# EAGLE design counter-defender-esp8266-mk-1.0 (EAGLE 7.5.0)
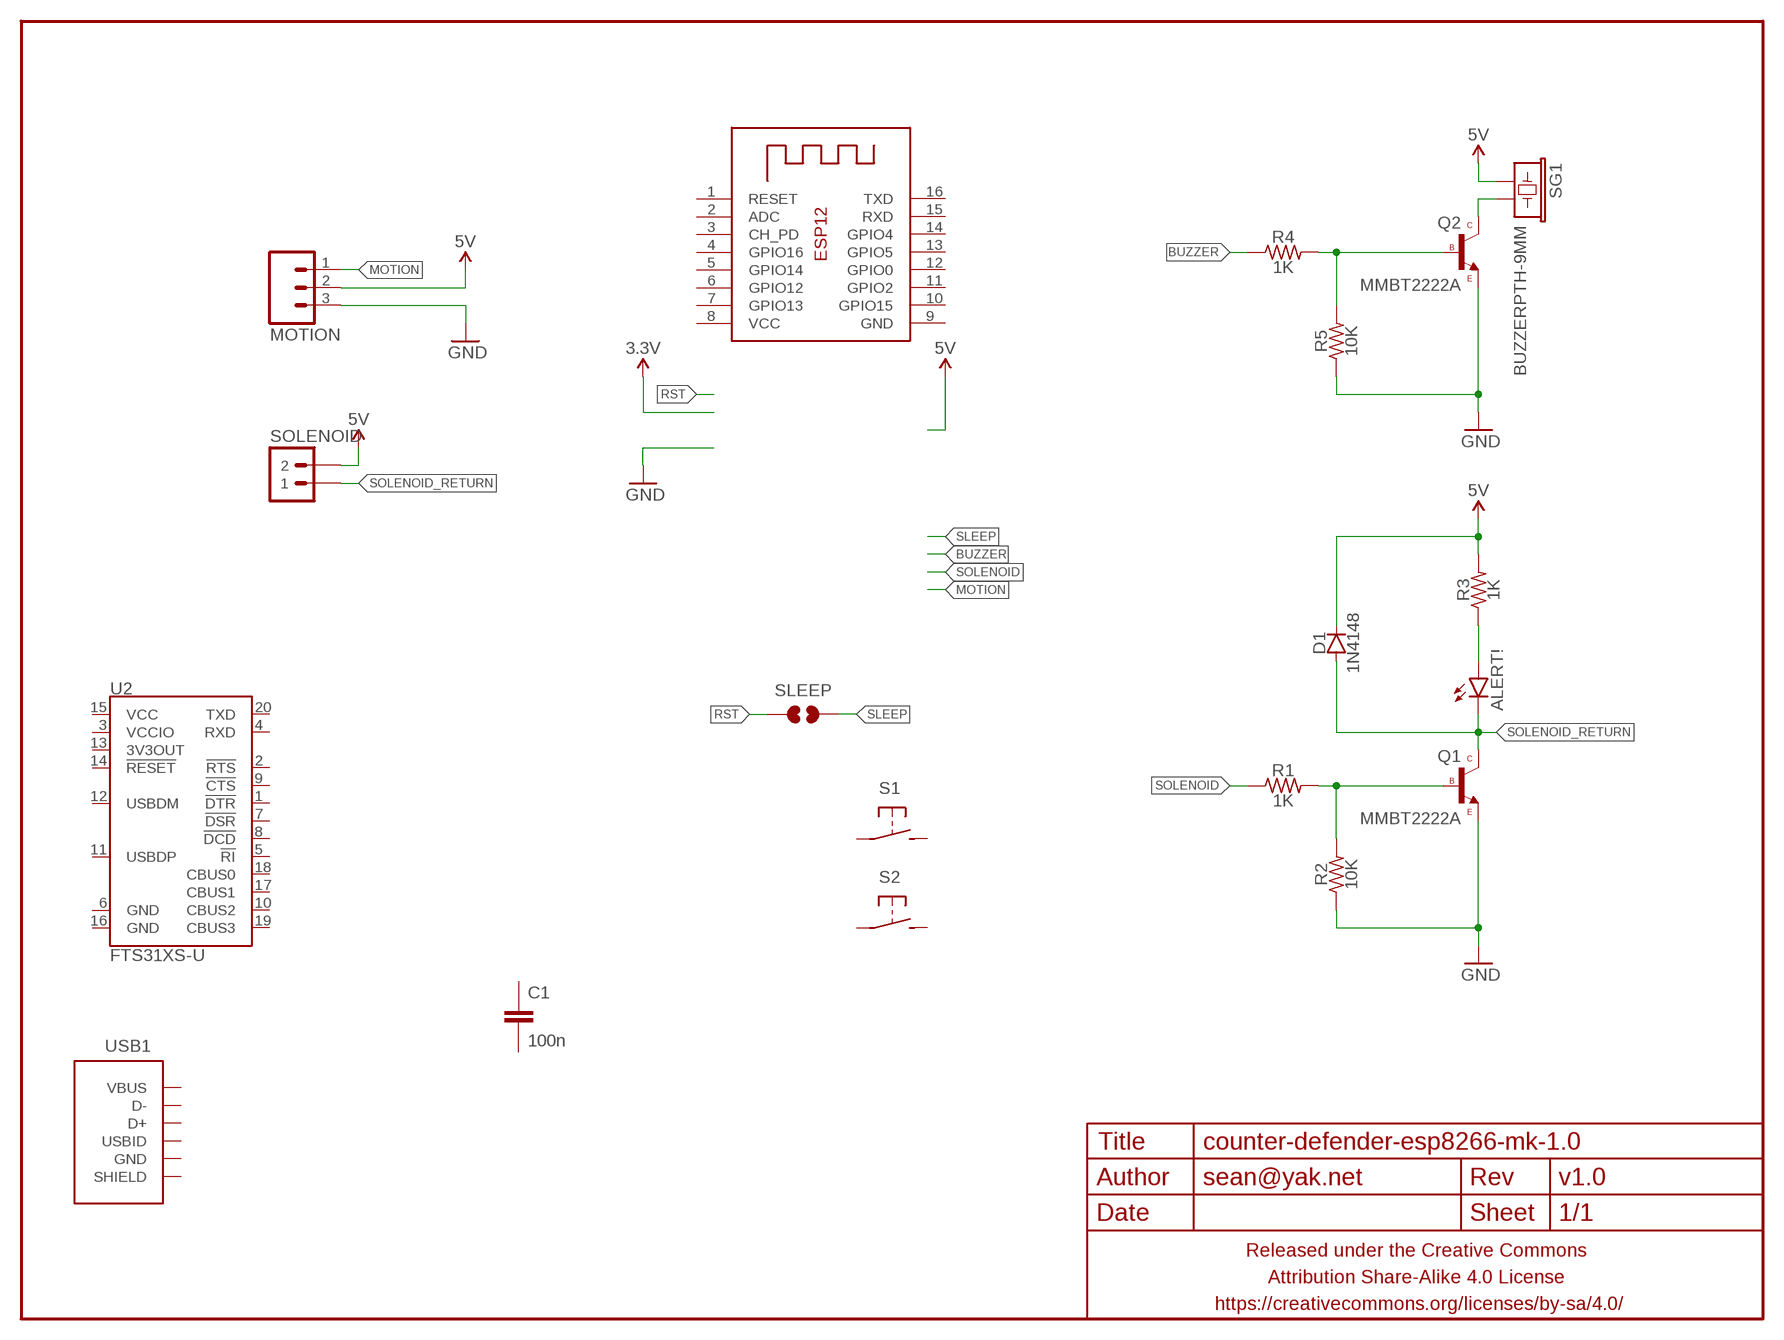
[diagram p0: schematic, sheet 1]

## Parts
ALERT!  LED0603-TIGHT  [LED-0603-TIGHT]
C1  100n  CAPACITOR-CERAMICC0603-TIGHTER  [C0603-TIGHTER]
D1  1N4148  DIODESOD123  [SOD123]
FRAME1  FRAME-LETTERNO_PACKAGE  [DUMMY]
MOTION  M03PTH-CENTERED  [1X03-CENTERED]
Q1  MMBT2222A  TRANSISTOR_NPNMMBT2222A  [SOT23]
Q2  MMBT2222A  TRANSISTOR_NPNMMBT2222A  [SOT23]
R1  1K  RESISTORR0603-TIGHTER  [R0603-TIGHTER]
R2  10K  RESISTORR0603-TIGHTER  [R0603-TIGHTER]
R3  1K  RESISTORR0603-TIGHTER  [R0603-TIGHTER]
R4  1K  RESISTORR0603-TIGHTER  [R0603-TIGHTER]
R5  10K  RESISTORR0603-TIGHTER  [R0603-TIGHTER]
S1  SPST-NO-TACTSMD-TINIER  [TACTILE_SWITCH_SMD_TINY]
S2  SPST-NO-TACTSMD-TINIER  [TACTILE_SWITCH_SMD_TINY]
SG1  BUZZERPTH-9MM  [BUZZER-PTH-9MM]
SLEEP  JUMPER-PAD-2-NOYES_SILK  [PAD-JUMPER-2-NO_YES_SILK]
SOLENOID  M02PTH-CENTERED  [1X02-CENTER]
U1  ESP-12  [ESP-12]
U2  FTS31XS-U  FT231XS  [SSOP20_L]
USB1  USB-AB-SHIELDFCI-10118193-USB-MICRO-B  [FCI-10118193-USB-MICRO-B]

## Nets
5V: D1.C MOTION.2 R3.2 SG1.+ SOLENOID.2
BUZZER: R4.1
GND: MOTION.3 Q1.2(E) Q2.2(E) R2.1 R5.1
MOTION: MOTION.1
N$1: ALERT!.A R3.1
N$2: Q1.1(B) R1.2 R2.2
N$3: Q2.3(C) SG1.-
N$5: Q2.1(B) R4.2 R5.2
RST: SLEEP.1
SLEEP: SLEEP.2
SOLENOID: R1.1
SOLENOID_RETURN: ALERT!.C D1.A Q1.3(C) SOLENOID.1
Unconnected: C1.1 C1.2 S1.P$1 S1.P$2 S2.P$1 S2.P$2 U1.1(RESET) U1.2(ADC) U1.3(CH_PD) U1.4(GPIO16) U1.5(GPIO14) U1.6(GPIO12) U1.7(GPIO13) U1.10(GPIO15) U1.11(GPIO2) U1.12(GPIO0) U1.13(GPIO5) U1.14(GPIO4) U1.15(RXD) U1.16(TXD) U2.1(!DTR) U2.2(!RTS) U2.3(VCCIO) U2.4(RXD) U2.5(!RI) U2.6(GND) U2.7(!DSR) U2.8(!DCD) U2.9(!CTS) U2.10(CBUS2) U2.11(USBDP) U2.12(USBDM) U2.13(3V3OUT) U2.14(!RESET) U2.15(VCC) U2.16(GND) U2.17(CBUS1) U2.18(CBUS0) U2.19(CBUS3) U2.20(TXD) USB1.1(VBUS) USB1.2(D-) USB1.3(D+) USB1.4(USBID) USB1.5(GND) USB1.SHIELD@1(SHIELD) USB1.SHIELD@2(SHIELD) USB1.SHIELD@3(SHIELD) USB1.SHIELD@4(SHIELD)

## Power pins joined to a net without a drawn wire
GND: U1.9(GND)
VCC: U1.8(VCC)

## Library data of the parts
ALERT! = a_parts:LED: LEDs Standard schematic elements and footprints for 5mm, 3mm, 1206, and 0603 sized LEDs. 5mm - Spark Fun Electronics SKU : COM-00529 (and others)
C1 = a_parts:CAPACITOR-CERAMIC: CAPACITOR, European symbol
D1 = a_parts:DIODE: Diode These are standard reverse protection diodes and small signal diodes. SMA package can handle up to about 1A. SOD-323 can handle about 200mA. What the SOD-323 package when ordering, there are some mfgs out there that are 5-pin packages.
FRAME1 = a_parts:FRAME-LETTER: Schematic Frame Standard 8.5x11 US Letter frame; DESIGNER: sean@yak.net; VERSION: v1.0
MOTION = a_parts:M03: Header 3 Standard 3-pin 0.1" header. Use with straight break away headers (SKU : PRT-00116), right angle break away headers (PRT-00553), swiss pins (PRT-00743), machine pins (PRT-00117), and female headers (PRT-00115). Molex polarized connector foot print use with SKU : PRT-08232 with associated crimp pins and housings.
Q1 Q2 = a_parts:TRANSISTOR_NPN: Generic NPN BJT MMBT2222A - TRANS-08049 (SOT-23, 1A 40V) MPSA42 - TRANS-09116 (SOT-23, 500mA 300V) MMBT5088LT1G - TRANS-11160 (SOT-23, 50 mA 30V) BC547 - COM-08928 <http://www.sparkfun.com/products/8928> (TO-92 45V 100mA) (1.Collector 2.Base 3.Emitter) 2N3904 - COM-00521 <http://www.sparkfun.com/products/521> (TO-92 40V 200mA) (1.Emitter 2.Base 3.Collector) P2N2222A - COM-12852 <http://www.sparkfun.com/products/12852> (TO-92 40V 600mA) (1.Collector 2.Base 3.Emitter)
R1-R5 = a_parts:RESISTOR: RESISTOR, American symbol
S1 S2 = a_parts:SPST-NO-TACT
SG1 = a_parts:BUZZER: Buzzer 12mm Spark Fun Electronics SKU : Comp-Buzzer
SLEEP = a_parts:JUMPER-PAD-2-NO
SOLENOID = a_parts:M02: Standard 2-pin 0.1" header. Use with - straight break away headers ( PRT-00116) - right angle break away headers (PRT-00553) - swiss pins (PRT-00743) - machine pins (PRT-00117) - female headers (PRT-00115) Molex polarized connector foot print use with: PRT-08233 with associated crimp pins and housings. 2.54_SCREWTERM for use with PRT-10571. 3.5mm Screw Terminal footprints for PRT-08084 5mm Screw Terminal footprints for use with PRT-08433
U1 = a_parts:ESP-12
U2 = a_parts:FT231X: FTDI FT231X Full Speed USB to Full-handshake UART This USB2.0 Full Speed IC offers a compact bridge to full handshake UART interfaces. The device is a UART, capable of operating up to 3MBaud, with low power consumption (8mA). The FT231X includes the complete FT-X series feature set and enables USB to be added into a system design quickly and easily over a UART interface.; PROD_ID: IC-11524
USB1 = a_parts:USB-AB-SHIELD

## Board
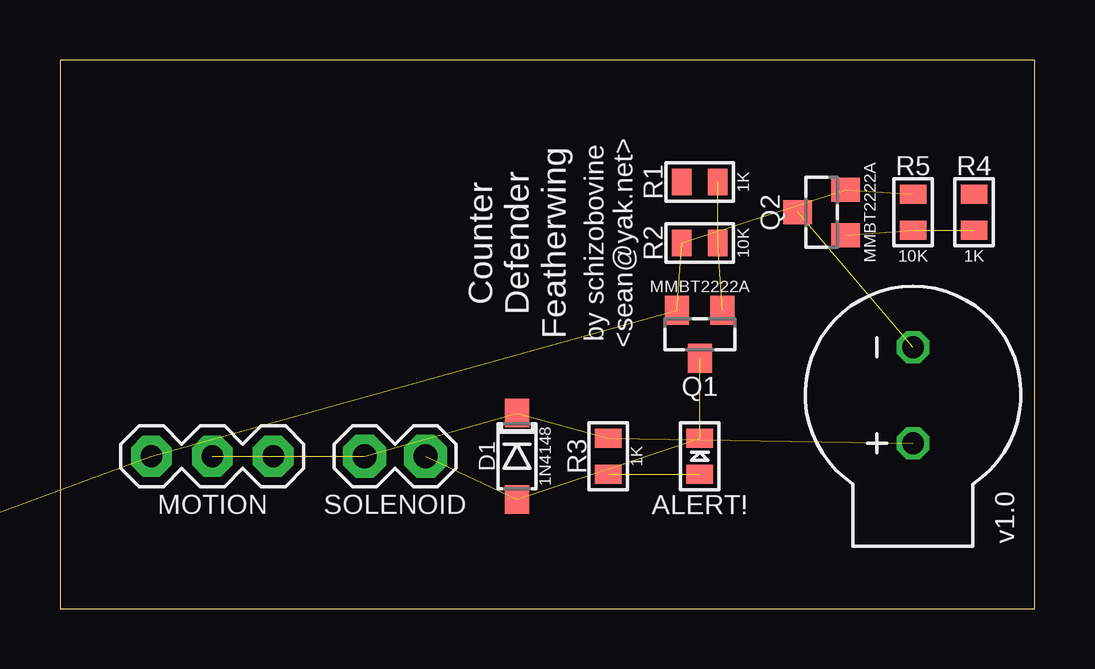
[diagram p1: board, top side]
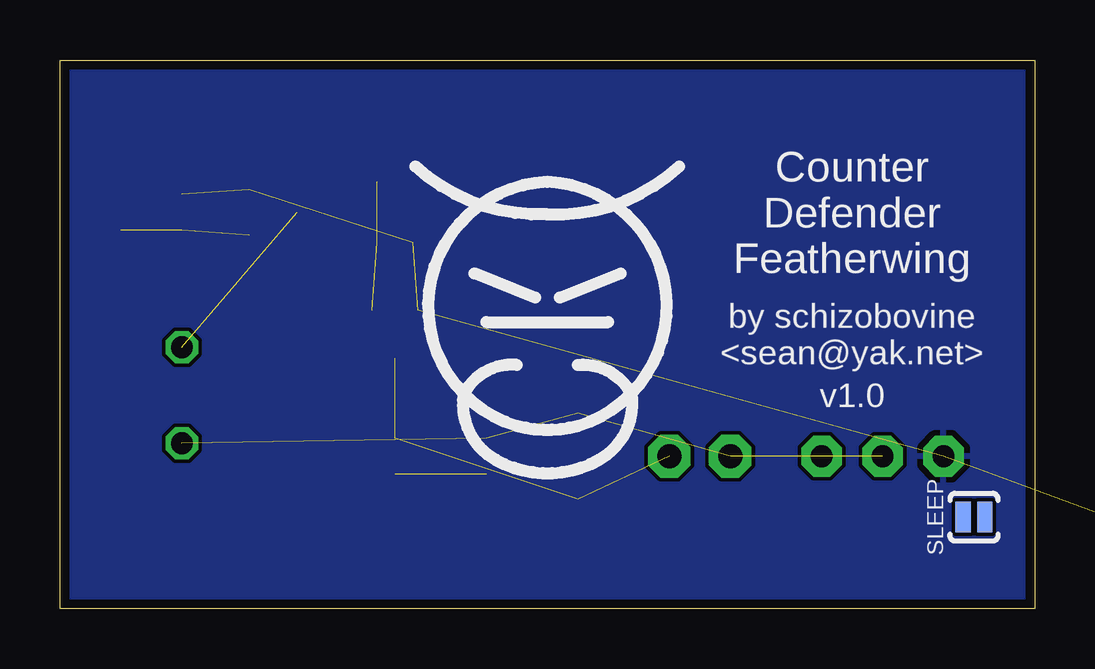
[diagram p2: board, bottom side, seen from below]

Size 40.64 x 22.86 mm. Coordinates in mm from the lower left corner, seen from the top.
Outline: 0,0 40.64,0 40.64,22.86 0,22.86 0,0
Copper layers (1*16): Top 0.0356mm / dielectric 1.5011mm / Bottom 0.0356mm
Design rules "LaenPCBOrder2": minimum track width 6mil, minimum drill 13mil, track to track 6mil, track to pad 6mil, pad to pad 6mil, via to via 6mil, smd to smd 6mil, copper to edge 15mil, drill to drill 6mil, minimum pad ring 7mil, minimum via ring 7mil, stop-mask expansion 3mil, vias tented up to drill 20mil, thermal gap 10mil

### Footprints (pad centres in the part's own frame; a part is rotated, then mirrored left to right if it is on the bottom)
LED-0603-TIGHT = smd 0.8 x 1.1: A 0.75,0; C -0.75,0
C0603-TIGHTER = smd 0.8 x 1.1: 1 -0.75,0; 2 0.75,0
SOD123 = smd 1.2 x 1: A -1.8,0; C 1.8,0
1X03-CENTERED = drill 0.9 pad 1.7 octagon: 1 -2.54,0; 2 0,0; 3 2.54,0
SOT23 = smd 1 x 1.2: 1 -0.95,-1; 2 0.95,-1; 3 0,1
R0603-TIGHTER = smd 0.8 x 1.1: 1 -0.75,0; 2 0.75,0
TACTILE_SWITCH_SMD_TINY = smd 1.27 x 1.5: P$1 -2.5,0; P$2 2.5,0
BUZZER-PTH-9MM = drill 0.9 octagon: + -2,0; - 2,0
PAD-JUMPER-2-NO_YES_SILK = smd 0.635 x 1.27: 1 -0.45,0; 2 0.45,0
1X02-CENTER = drill 1 pad 1.778 octagon: 1 -1.27,0; 2 1.27,0
ESP-12 = smd 2 x 1.2: 1 -7.5,4.5; 2 -7.5,2.5; 3 -7.5,0.5; 4 -7.5,-1.5; 5 -7.5,-3.5; 6 -7.5,-5.5; 7 -7.5,-7.5; 8 -7.5,-9.5; 9 7.5,-9.5; 10 7.5,-7.5; 11 7.5,-5.5; 12 7.5,-3.5; 13 7.5,-1.5; 14 7.5,0.5; 15 7.5,2.5; 16 7.5,4.5
SSOP20_L = smd 0.43 x 1.27: 1 -2.857,-2.68; 2 -2.223,-2.68; 3 -1.587,-2.68; 4 -0.953,-2.68; 5 -0.318,-2.68; 6 0.318,-2.68; 7 0.953,-2.68; 8 1.587,-2.68; 9 2.223,-2.68; 10 2.857,-2.68; 11 2.857,2.68; 12 2.223,2.68; 13 1.587,2.68; 14 0.953,2.68; 15 0.318,2.68; 16 -0.318,2.68; 17 -0.953,2.68; 18 -1.587,2.68; 19 -2.223,2.68; 20 -2.857,2.68
FCI-10118193-USB-MICRO-B = smd 0.4 x 1.6: 1 -1.3,2.8; 2 -0.65,2.8; 3 0,2.8; 4 0.65,2.8; 5 1.3,2.8 | smd 1.8 x 1.4: SHIELD@1 -3.3,2.45; SHIELD@2 3.3,2.45 | drill 1.2 pad 1.8 square: SHIELD@3 -3.4,0; SHIELD@4 3.4,0

### Placement (x,y rotation side)
ALERT!  26.67,6.35 270 top
C1  -38.1,-25.72 0 top  (outside the outline)
D1  19.05,6.35 90 top
FRAME1  0,0 0 top
MOTION  6.35,6.35 180 top
Q1  26.67,11.43 180 top
Q2  31.75,16.51 90 top
R1  26.67,17.78 0 top
R2  26.67,15.24 0 top
R3  22.86,6.35 90 top
R4  38.1,16.51 270 top
R5  35.56,16.51 270 top
S1  -37.15,-17.78 0 top  (outside the outline)
S2  -37.15,-22.23 0 top  (outside the outline)
SG1  35.56,8.89 90 top
SLEEP  2.54,3.81 180 bottom
SOLENOID  13.97,6.35 180 top
U1  -32.07,5.4 0 top  (outside the outline)
U2  -34.92,-11.43 0 top  (outside the outline)
U$1  [COW]  20.32,11.43 0 bottom
USB1  -35.56,-30.48 0 top  (outside the outline)

### Tracks (layer width: path | path; a pad name or v marks a point on that pad's centre or on a via)
5V  (4 unrouted)
GND  (5 unrouted)
  pour Bottom (rank 6): 40.64,0 40.64,22.86 0,22.86 0,0
N$1  (1 unrouted)
N$2  (2 unrouted)
N$3  (1 unrouted)
N$5  (2 unrouted)
SOLENOID_RETURN  (3 unrouted)

### Text on the board
tPlace: Counter / Defender / Featherwing | by schizobovine / <sean@yak.net>
bPlace: Counter / Defender / Featherwing | by schizobovine / <sean@yak.net>